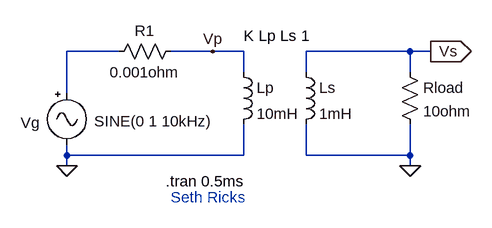
[diagram p0: schematic part2.asc]
part2.asc, the LTspice schematic file:
Version 4.1
SHEET 1 880 680
WIRE 80 64 0 64
WIRE 224 64 160 64
WIRE 272 64 224 64
WIRE 528 64 368 64
WIRE 560 64 528 64
WIRE 272 96 272 64
WIRE 368 96 368 64
WIRE 528 96 528 64
WIRE 0 128 0 64
WIRE 0 224 0 208
WIRE 272 224 272 176
WIRE 272 224 0 224
WIRE 368 224 368 176
WIRE 528 224 528 176
WIRE 528 224 368 224
WIRE 0 240 0 224
WIRE 528 240 528 224
FLAG 0 240 0
FLAG 528 240 0
FLAG 560 64 Vs
IOPIN 560 64 Out
FLAG 224 64 Vp
SYMBOL Misc\\signal 0 112 R0
WINDOW 0 -71 62 Left 2
WINDOW 3 42 59 Left 2
SYMATTR InstName Vg
SYMATTR Value SINE(0 1 10kHz)
SYMBOL res 176 48 R90
WINDOW 0 0 56 VBottom 2
WINDOW 3 32 56 VTop 2
SYMATTR InstName R1
SYMATTR Value 0.001ohm
SYMBOL ind 256 80 R0
SYMATTR InstName Lp
SYMATTR Value 10mH
SYMATTR Type ind
SYMBOL ind 352 80 R0
SYMATTR InstName Ls
SYMATTR Value 1mH
SYMATTR Type ind
SYMBOL res 512 80 R0
SYMATTR InstName Rload
SYMATTR Value 10ohm
TEXT 152 264 Left 2 !.tran 0.5ms
TEXT 160 288 Left 2 ;Seth Ricks
TEXT 272 40 Left 2 !K Lp Ls 1

The netlist it stands for:
* part2.asc
Vg N001 0 SINE(0 1 10kHz)
R1 Vp N001 0.001ohm
Lp Vp 0 10mH
Ls Vs 0 1mH
Rload Vs 0 10ohm
.tran 0.5ms
* Seth Ricks
K Lp Ls 1
.backanno
.end

* Results of the author's LTspice run, read from the files saved beside the schematic
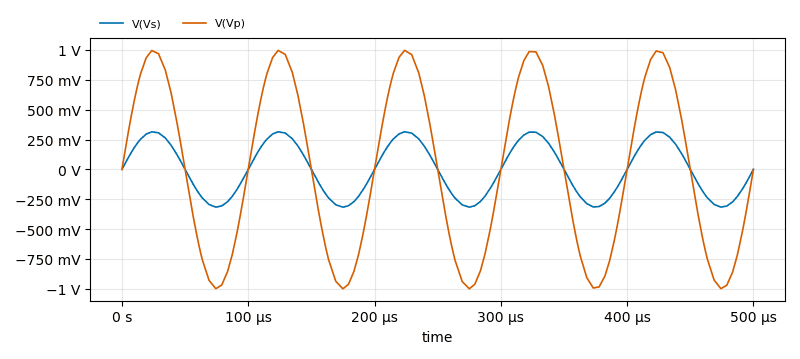
[diagram p1: Transient Analysis of part2.asc, plotted from the saved traces]
* Transient Analysis, 1 run:
*   V(Vs): min -316.1 mV, max 315.2 mV, average -49.41 µV, rms 222.5 mV, last 0 V
*   V(Vp): min -999.8 mV, max 996.8 mV, average -156.3 µV, rms 703.8 mV, last 0 V